# Altium project FMC_ADC_100M_10B_16CHA_TDC.PrjPCB (part 2 of 4)

## Sheet Clock_circuit.SchDoc: FMC_ADC
size 420 x 297 mm; Author: G.Kasprowicz; CompanyName: WUT ISE; DrawnBy: G.Kasprowicz; Organization: WUT ISE; Address1: PW ISE; Address2: Nowowiejska 15/19 00-665 Warsaw; Address3: gkasprow@gmail.com; DocumentNumber: 6; Revision: 2; SheetNumber: 6; SheetTotal: 12; ModifiedBy: -; CheckedDate: -; Title2: Clock distribution; DivGrp: WUT ISE; Designer: G.Kasprowicz; ModifiedDate: -; ProjectName: Sensor Box
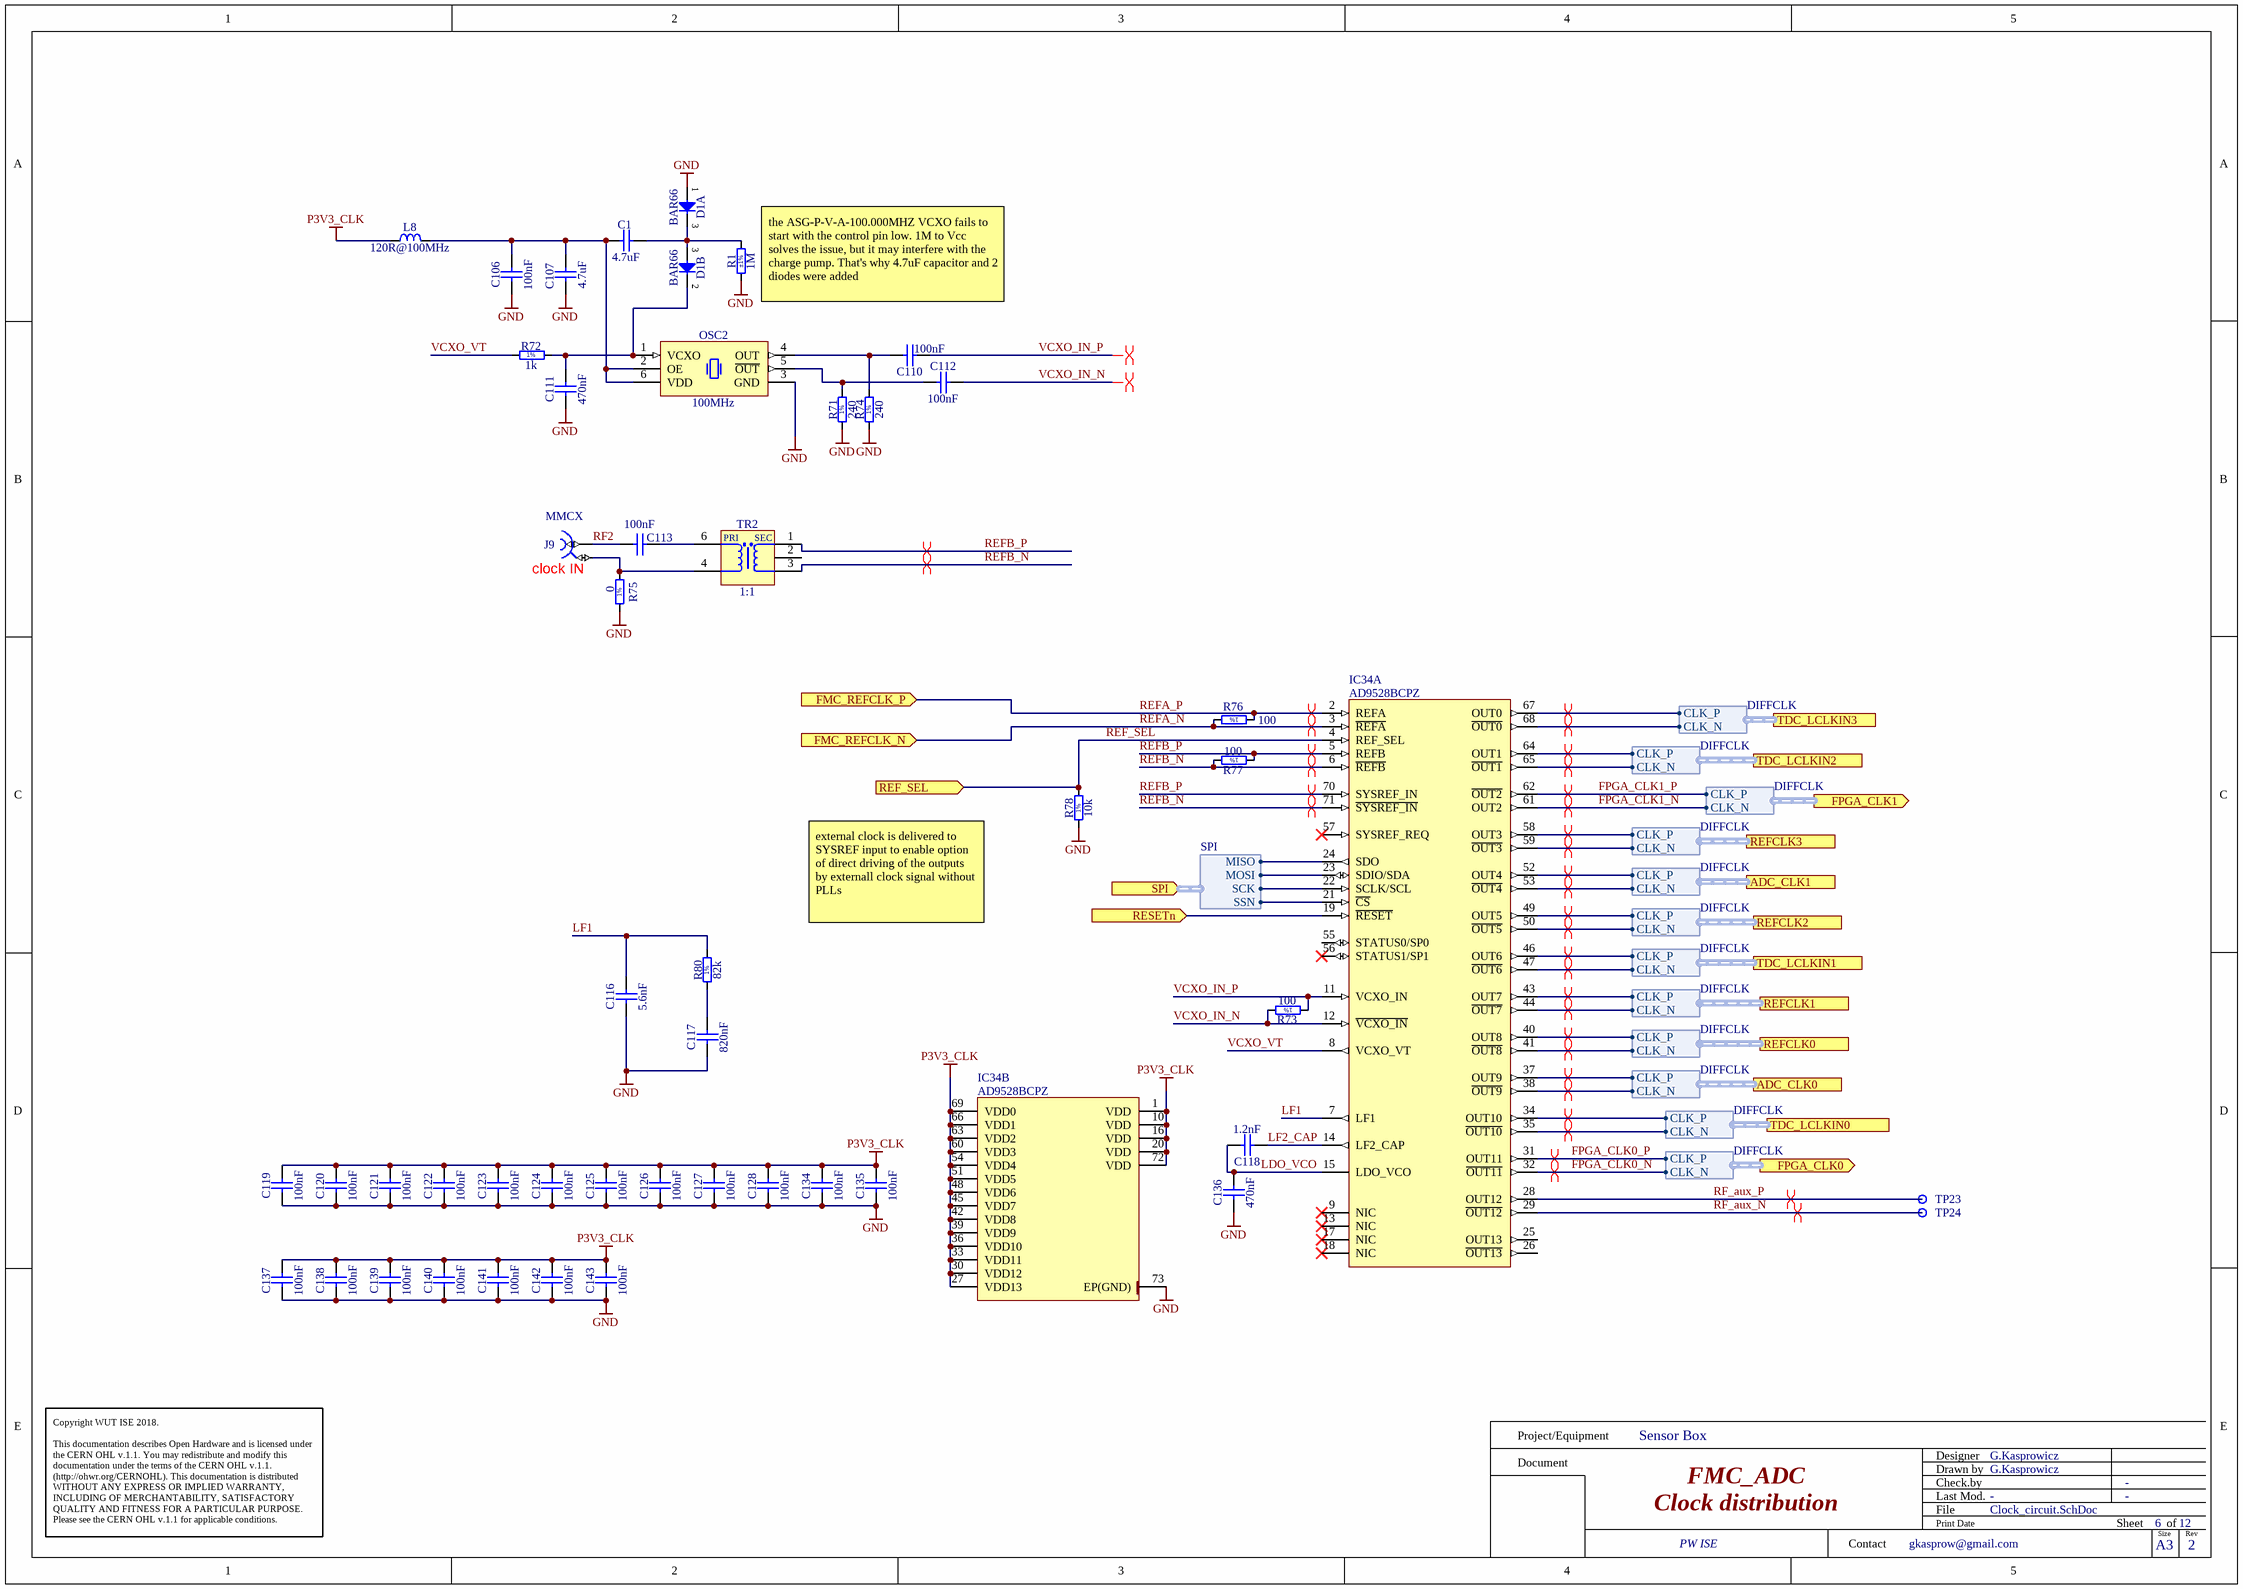
[diagram p3: Clock_circuit.SchDoc]

### Parts
C1  4.7uF  [CAPC1608X87N]
C106  100nF  [CAPC0603X33N]
C107  4.7uF  [CAPC1608X87N]
C110  100nF  [CAPC0603X33N]
C111  470nF  [CAPC1005X55N]
C112  100nF  [CAPC0603X33N]
C113  100nF  [CAPC0603X33N]
C116  5.6nF  [CAPC2012X88N]
C117  820nF  [CAPC3216X130N]
C118  1.2nF  [CAPC1608X80N]
C119  100nF  [CAPC0603X33N]
C120  100nF  [CAPC0603X33N]
C121  100nF  [CAPC0603X33N]
C122  100nF  [CAPC0603X33N]
C123  100nF  [CAPC0603X33N]
C124  100nF  [CAPC0603X33N]
C125  100nF  [CAPC0603X33N]
C126  100nF  [CAPC0603X33N]
C127  100nF  [CAPC0603X33N]
C128  100nF  [CAPC0603X33N]
C134  100nF  [CAPC0603X33N]
C135  100nF  [CAPC0603X33N]
C136  470nF  [CAPC1005X55N]
C137  100nF  [CAPC0603X33N]
C138  100nF  [CAPC0603X33N]
C139  100nF  [CAPC0603X33N]
C140  100nF  [CAPC0603X33N]
C141  100nF  [CAPC0603X33N]
C142  100nF  [CAPC0603X33N]
C143  100nF  [CAPC0603X33N]
D1  BAR66  [SOT95P240X110-3N]  (parts A,B of 2)
IC34  AD9528BCPZ  [QFN50P1000X1000X100-73N-S545]  (parts A,B of 2)
J9  Family: MMCX  [HUBER-SUHNER_85_MMCX-50-0-1/111 OH]  (hidden comment: Coax_1Female_1Shield)
L8  120R@100MHz  [INDC1608X65N]
OSC2  100MHz  [OSCSC254P500X700X190-6N]
R1  1M  Tolerance: ±1%  [RESC1005X40N]
R71  240  [RESC1005X40N]
R72  1k  [RESC1005X40N]
R73  100  [RESC0603X28N]
R74  240  [RESC1005X40N]
R75  0  [RESC1005X40N]
R76  100  [RESC0603X28N]
R77  100  [RESC0603X28N]
R78  10k  [RESC1005X40N]
R80  82k  [RESC1005X40N]
TP23  Test Point  [TPS127]  (value not drawn)
TP24  Test Point  [TPS127]  (value not drawn)
TR2  1:1  [XFMR_MINI-CIRCUITS_AT224-1]

### Ports
ADC_CLK0 (harness DIFFCLK), ADC_CLK1 (harness DIFFCLK), FMC_REFCLK_N (in), FMC_REFCLK_P (in), FPGA_CLK0 (out, harness DIFFCLK), FPGA_CLK1 (out, harness DIFFCLK), REF_SEL (in), REFCLK0 (harness DIFFCLK), REFCLK1 (harness DIFFCLK), REFCLK2 (harness DIFFCLK), REFCLK3 (harness DIFFCLK), RESETn (in), SPI (in, harness SPI), TDC_LCLKIN0 (harness DIFFCLK), TDC_LCLKIN1 (harness DIFFCLK), TDC_LCLKIN2 (harness DIFFCLK), TDC_LCLKIN3 (harness DIFFCLK)

### Harnesses
DIFFCLK: CLK_P, CLK_N
SPI: MISO, MOSI, SCK, SSN

### Nets
GND: C106.1 C107.1 C111.1 C116.1 C117.1 C119.1 C120.1 C121.1 C122.1 C123.1 C124.1 C125.1 C126.1 C127.1 C128.1 C134.1 C135.1 C136.1 C137.1 C138.1 C139.1 C140.1 C141.1 C142.1 C143.1 D1.1(A) IC34.73(EP(GND)) OSC2.3(GND) R1.1 R71.1 R74.1 R75.1 R78.1
P3V3_CLK: C119.2 C120.2 C121.2 C122.2 C123.2 C124.2 C125.2 C126.2 C127.2 C128.2 C134.2 C135.2 C137.2 C138.2 C139.2 C140.2 C141.2 C142.2 C143.2 IC34.1(VDD) IC34.10(VDD) IC34.16(VDD) IC34.20(VDD) IC34.27(VDD13) IC34.30(VDD12) IC34.33(VDD11) IC34.36(VDD10) IC34.39(VDD9) IC34.42(VDD8) IC34.45(VDD7) IC34.48(VDD6) IC34.51(VDD5) IC34.54(VDD4) IC34.60(VDD3) IC34.63(VDD2) IC34.66(VDD1) IC34.69(VDD0) IC34.72(VDD) L8.1
ADC_CLK_N: IC34.38(~{OUT9}) ; port ADC_CLK0.CLK_N
ADC_CLK_N: IC34.53(~{OUT4}) ; port ADC_CLK1.CLK_N  [a separate net that carries the same name]
ADC_CLK_P: IC34.37(OUT9) ; port ADC_CLK0.CLK_P
ADC_CLK_P: IC34.52(OUT4) ; port ADC_CLK1.CLK_P  [a separate net that carries the same name]
CLK_SSN: IC34.21(~{CS}) ; port SPI.SSN
FPGA_CLK0_N: IC34.32(~{OUT11}) ; port FPGA_CLK0.CLK_N  [project net CLK0_M2C_N]
FPGA_CLK0_P: IC34.31(OUT11) ; port FPGA_CLK0.CLK_P  [project net CLK0_M2C_P]
FPGA_CLK1_N: IC34.61(OUT2) ; port FPGA_CLK1.CLK_N  [project net CLK1_M2C_N]
FPGA_CLK1_P: IC34.62(~{OUT2}) ; port FPGA_CLK1.CLK_P  [project net CLK1_M2C_P]
LCLKIN_N: IC34.35(~{OUT10}) ; port TDC_LCLKIN0.CLK_N
LCLKIN_N: IC34.47(~{OUT6}) ; port TDC_LCLKIN1.CLK_N  [a separate net that carries the same name]
LCLKIN_N: IC34.65(~{OUT1}) ; port TDC_LCLKIN2.CLK_N  [a separate net that carries the same name]
LCLKIN_N: IC34.68(~{OUT0}) ; port TDC_LCLKIN3.CLK_N  [a separate net that carries the same name]
LCLKIN_P: IC34.34(OUT10) ; port TDC_LCLKIN0.CLK_P
LCLKIN_P: IC34.46(OUT6) ; port TDC_LCLKIN1.CLK_P  [a separate net that carries the same name]
LCLKIN_P: IC34.64(OUT1) ; port TDC_LCLKIN2.CLK_P  [a separate net that carries the same name]
LCLKIN_P: IC34.67(OUT0) ; port TDC_LCLKIN3.CLK_P  [a separate net that carries the same name]
LDO_VCO: C118.2 C136.2 IC34.15(LDO_VCO)
LF1: C116.2 IC34.7(LF1) R80.2
LF2_CAP: C118.1 IC34.14(LF2_CAP)
REF_SEL: IC34.4(REF_SEL) R78.2 ; port REF_SEL
REFA_N: IC34.3(~{REFA}) R76.2 ; port FMC_REFCLK_N
REFA_P: IC34.2(REFA) R76.1 ; port FMC_REFCLK_P
REFB_N: IC34.6(~{REFB}) IC34.71(~{SYSREF_IN}) R77.2 TR2.3(S)
REFB_P: IC34.5(REFB) IC34.70(SYSREF_IN) R77.1 TR2.1(SDOT)
REFCLK_N: IC34.41(~{OUT8}) ; port REFCLK0.CLK_N
REFCLK_N: IC34.44(~{OUT7}) ; port REFCLK1.CLK_N  [a separate net that carries the same name]
REFCLK_N: IC34.50(~{OUT5}) ; port REFCLK2.CLK_N  [a separate net that carries the same name]
REFCLK_N: IC34.59(~{OUT3}) ; port REFCLK3.CLK_N  [a separate net that carries the same name]
REFCLK_P: IC34.40(OUT8) ; port REFCLK0.CLK_P
REFCLK_P: IC34.43(OUT7) ; port REFCLK1.CLK_P  [a separate net that carries the same name]
REFCLK_P: IC34.49(OUT5) ; port REFCLK2.CLK_P  [a separate net that carries the same name]
REFCLK_P: IC34.58(OUT3) ; port REFCLK3.CLK_P  [a separate net that carries the same name]
RF2: C113.2 J9.1
RF_aux_N: IC34.29(~{OUT12}) TP24.1
RF_aux_P: IC34.28(OUT12) TP23.1
TDC_MISO: IC34.24(SDO) ; port SPI.MISO
TDC_MOSI: IC34.23(SDIO/SDA) ; port SPI.MOSI
TDC_SCK: IC34.22(SCLK/SCL) ; port SPI.SCK
VCXO_IN_N: C112.2 IC34.12(~{VCXO_IN}) R73.2
VCXO_IN_P: C110.1 IC34.11(VCXO_IN) R73.1
VCXO_VT: IC34.8(VCXO_VT) R72.1
NetC1_1: C1.1 C106.2 C107.2 L8.2 OSC2.2(OE) OSC2.6(VDD)
NetC1_2: C1.2 D1.3(COMAC) R1.2
NetC110_2: C110.2 OSC2.4(OUT) R74.2
NetC111_2: C111.2 D1.2(C) OSC2.1(VCXO) R72.2
NetC112_1: C112.1 OSC2.5(~{OUT}) R71.2
NetC113_1: C113.1 TR2.6(PDOT)
NetC117_2: C117.2 R80.1
NetIC5_13: IC34.19(~{RESET}) ; port RESETn
NetJ9_2: J9.2 R75.2 TR2.4(P)

Not connected (* = marked no-connect by the designer): IC34 9(NIC)* 13(NIC)* 17(NIC)* 18(NIC)* 25(OUT13) 26(~{OUT13}) 55(STATUS0/SP0) 56(STATUS1/SP1)* 57(SYSREF_REQ)*; TR2 2(NU)

### Layout directives
differential pair: ADC_CLK_N, ADC_CLK_P, CLK0_M2C_N, CLK0_M2C_P, CLK1_M2C_N, CLK1_M2C_P, LCLKIN_N, LCLKIN_P, REFA_N, REFA_P, REFB_N, REFB_P, REFCLK_N, REFCLK_P, RF_aux_N, RF_aux_P, VCXO_IN_N, VCXO_IN_P

### Notes on the sheet
- (near R1) the ASG-P-V-A-100.000MHZ VCXO fails to start with the control pin low. 1M to Vcc solves the issue, but it may interfere with the charge pump. That's why 4.7uF capacitor and 2 diodes were added
- (near J9) clock IN
- external clock is delivered to SYSREF input to enable option of direct driving of the outputs by externall clock signal without PLLs
- Project/Equipment
- Document
- Designer
- Drawn by
- Check.by
- Copyright WUT ISE 2018.
  This documentation describes Open Hardware and is licensed under the CERN OHL v.1.1. You may redistribute and modify this documentation under the terms of the CERN OHL v.1.1. (http://ohwr.org/CERNOHL). This documentation is distributed WITHOUT ANY EXPRESS OR IMPLIED WARRANTY, INCLUDING OF MERCHANTABILITY, SATISFACTORY QUALITY AND FITNESS FOR A PARTICULAR PURPOSE. Please see the CERN OHL v.1.1 for applicable conditions.
- Contact
- File
- Last Mod.
- Print Date
- Sheet
- Size
- A3
- of
- Rev
- (in symbol R0201_100R_1%_0.05W_200PPM) 1%
- (in symbol R0402_0R_JUMPER) 1%
- (in symbol R0402_1K_1%_0.0625W_100PPM) 1%
- (in symbol R0402_10K_1%_0.0625W_100PPM) 1%
- (in symbol R0402_82K_1%_0.0625W_100PPM) 1%
- (in symbol R0402_240R_1%_0.0625W_100PPM) 1%
- (in symbol XFMR_MINI-CIRCUITS_TC1-1+) PRI; SEC

### Library data of the parts
C1 C107 = CC0603_4.7UF_6.3V_10%_X5R: Non-polarised capacitor; Part Description: SMD Multilayer Chip Ceramic Capacitor; Manufacturer: GENERIC; Manufacturer1 Part Number: 225520613672; Voltage: 6.3V; TC: X5R; Tolerance: ±10%; Part Number: CC0603_4.7UF_6.3V_10%_X5R; Component Kind: Standard; Component Type: Standard; Pin Count: 2; Value: 4.7uF; Status: Preferred; Manufacturer Part Number: CC0603_4.7uF_6.3V_10%_X5R; Case: 0603; Mounted: Yes; Socket: No; SMD: Yes; Manufacturer1 Example: PHYCOMP; Manufacturer1 ComponentHeight: 0.87mm; HelpURL: \\cern.ch\dfs\Applications\Altium\Datasheets\CC0805_X5R_PHYCOMP_HC.pdf; Author: CERN DEM JLC; CreateDate: 03.12.2007; LatestRevisionDate: 03.12.2007; Sense: No
C106 C110 C112 C119-C128 C134 C135 C137-C143 = CC0201_100NF_6.3V_10%_X5R: Non-polarised capacitor; Part Description: SMD Multilayer Chip Ceramic Capacitor; Manufacturer: GENERIC; Manufacturer1 Part Number: 02016D104KAT2A; Tolerance: ±10%; Voltage: 6.3V; TC: X5R; Value: 100nF; Part Number: CC0201_100NF_6.3V_10%_X5R; Component Kind: Standard; Component Type: Standard; Pin Count: 2; Status: Not Recommended; Manufacturer Part Number: CC0201_100NF_6.3V_10%_X5R; Case: 0201; Mounted: Yes; Socket: No; SMD: Yes; Sense: No; Manufacturer1 Example: AVX; Manufacturer1 ComponentHeight: 0.33mm; HelpURL: \\cern.ch\dfs\Applications\Altium\Datasheets\CC0201_X5R_AVX.pdf; Author: CERN DEM JLC; CreateDate: 03.12.2007; LatestRevisionDate: 03.12.2007
C111 C136 = CC0402_470NF_6.3V_10%_X5R: Non-polarised capacitor; Part Description: SMD Multilayer Chip Ceramic Capacitor; Manufacturer: GENERIC; Manufacturer1 Part Number: GRM155R60J474KE19D; Tolerance: ±10%; Voltage: 6.3V; TC: X5R; Value: 470nF; Part Number: CC0402_470NF_6.3V_10%_X5R; Component Kind: Standard; Component Type: Standard; Pin Count: 2; Status: Preferred; Manufacturer Part Number: CC0402_470NF_6.3V_10%_X5R; Case: 0402; Mounted: Yes; Socket: No; SMD: Yes; Sense: No; Manufacturer1 Example: MURATA; Manufacturer1 ComponentHeight: 0.55mm; HelpURL: \\cern.ch\dfs\Applications\Altium\Datasheets\CC0402_X5R_MURATA_GRM.pdf; Author: CERN DEM JLC; CreateDate: 22.04.2010; LatestRevisionDate: 22.04.2010
C113 = CC0201_100NF_6.3V_10%_X5R: Non-polarised capacitor; Part Description: SMD Multilayer Chip Ceramic Capacitor; Manufacturer: GENERIC; Manufacturer1 Part Number: 02016D104KAT2A; Voltage: 6.3V; TC: X5R; Tolerance: ±10%; Table: Capacitors SMD; Part Number: CC0201_100NF_6.3V_10%_X5R; Component Kind: Standard; Component Type: Standard; Pin Count: 2; Value: 100nF; Status: Not Recommended; Manufacturer Part Number: CC0201_100NF_6.3V_10%_X5R; Case: 0201; Mounted: Yes; Socket: No; SMD: Yes; Manufacturer1 Example: AVX; Manufacturer1 ComponentHeight: 0.33mm; HelpURL: \\cern.ch\dfs\Applications\Altium\Datasheets\CC0201_X5R_AVX.pdf; Author: CERN DEM JLC; CreateDate: 2007-12-03; LatestRevisionDate: 2007-12-03
C116 = CC0805_5.6NF_50V_5%_C0G: Non-polarised capacitor; Part Description: SMD Multilayer Chip Ceramic Capacitor; Manufacturer: GENERIC; Manufacturer1 Part Number: GRM2195C1H562JA01D; Voltage: 50V; TC: C0G/NP0; Tolerance: ±5%; Part Number: CC0805_5.6NF_50V_5%_C0G; Component Kind: Standard; Component Type: Standard; Pin Count: 2; Value: 5.6nF; Status: Preferred; Manufacturer Part Number: CC0805_5.6NF_50V_5%_C0G; Case: 0805; Mounted: Yes; Socket: No; SMD: Yes; Sense: No; Manufacturer1 Example: Murata; Manufacturer1 ComponentHeight: 0.85mm; Author: *
C117 = CC1206_820NF_25V_10%_X7R: Non-polarised capacitor; Part Description: SMD Multilayer Chip Ceramic Capacitor; Manufacturer: GENERIC; Manufacturer1 Part Number: 12063C824KAT2A; Voltage: 25V; TC: X7R; Tolerance: ±10%; Part Number: CC1206_820NF_25V_10%_X7R; Component Kind: Standard; Component Type: Standard; Pin Count: 2; Value: 820nF; Manufacturer Part Number: CC1206_820NF_25V_10%_X7R; Case: 1206; Mounted: Yes; Socket: No; SMD: Yes; Sense: No; Manufacturer1 ComponentHeight: 1.25mm; Manufacturer1 Example: AVX
C118 = CC0603_1.2NF_50V_5%_C0G: Non-polarised capacitor; Part Description: SMD Multilayer Chip Ceramic Capacitor; Manufacturer: GENERIC; Manufacturer1 Part Number: C0603C122J5GACTU; Tolerance: ±5%; Voltage: 50V; TC: C0G/NP0; Value: 1.2nF; Part Number: CC0603_1.2NF_50V_5%_C0G; Component Kind: Standard; Component Type: Standard; Pin Count: 2; Status: Preferred; Manufacturer Part Number: CC0603_1.2NF_50V_5%_C0G; Case: 0603; Mounted: Yes; Socket: No; SMD: Yes; Sense: No; Manufacturer1 Example: KEMET; Manufacturer1 ComponentHeight: 0.8mm; Author: *
D1 = BAR66: Serial Diode; Part Description: Silicon PIN Diode Array (Series Connected); Manufacturer: INFINEON; Voltage: 150V; Power: 250mA; Table: Diodes; Part Number: BAR66; Component Kind: Standard; Component Type: Standard; Device: BAR66; PackageDescription: SOT23 3-Leads, Pitch 0.95mm - Body 1.3x2.9mm, IPC Medium Density; Manufacturer Part Number: BAR66; Pin Count: 3; Case: SOT23; Mounted: Yes; Socket: No; SMD: Yes; ComponentHeight: 1.1mm; HelpURL: \\cern.ch\dfs\Applications\Altium\Datasheets\BAR66.pdf; Author: CERN DEM JLC; CreateDate: 18/1/2010; LatestRevisionDate: 5/10/2010
IC34 = AD9528BCPZ: Clock Generator with 14 LVDS/HSTL Outputs; Manufacturer: ANALOG DEVICES; PressFit: No; Bonding: No; Part Number: AD9528BCPZ; Component Kind: Standard; Component Type: Standard; Device: AD9528BCPZ; PackageDescription: QFN,0.50mm Pitch, Square;72 Pin,10.00mm L X 10.00mm W X 1.00mm H Body (W/Thermal Tab 5.45mm X 5.45mm), IPC Medium Density; Part Description: Clock Generator with 14 LVDS/HSTL Outputs; Manufacturer Part Number: AD9528BCPZ; Pin Count: 73; Case: QFN72; Mounted: Yes; Socket: No; SMD: Yes; Sense: No; ComponentHeight: 1mm; HelpURL: \\cern.ch\dfs\Applications\Altium\Datasheets\AD9528BCPZ.pdf; Author: CERN DEM JLC; CreateDate: 11.10.2016; LatestRevisionDate: 11.10.2016
J9 = HUBER-SUHNER_85_MMCX-50-0-1/111 OH: Part Description: MMCX 50 Ohms Right Angle PCB Jack; Manufacturer: HUBER+SUHNER; Table: Miscellaneous; Part Number: HUBER-SUHNER_85_MMCX-50-0-1/111 OH; Component Kind: Standard; Component Type: Standard; Pin Count: 2; Mounted: Yes; Socket: No; SMD: No; Status: None; Manufacturer Part Number: 85_MMCX-50-0-1/111 OH; ComponentHeight: 9.6mm; HelpURL: \\cern.ch\dfs\Applications\Altium\Datasheets\HUBER-SUHNER_85_MMCX-50-0-1-111 OH.pdf; Author: CERN DEM JLC; CreateDate: 2011-10-04; LatestRevisionDate: 2011-10-04
L8 = IND0603_MURATA_BLM18SG121TN1D: Inductor; Part Description: SMD EMIFIL Suppression Chip Ferrite Bead; Manufacturer: MURATA; Power: 3A; Resistance: 0.025R; Tolerance: ±25%; Part Number: IND0603_MURATA_BLM18SG121TN1D; Component Kind: Standard; Component Type: Standard; Pin Count: 2; Value: 120R@100MHz; Status: None; Manufacturer Part Number: BLM18SG121TN1D; Case: 0603; Mounted: Yes; Socket: No; SMD: Yes; Sense: No; ComponentHeight: 0.65mm; HelpURL: \\cern.ch\dfs\Applications\Altium\Datasheets\IND0603_MURATA_BLM18S.pdf; Author: CERN DEM JLC; CreateDate: 23.07.2014; LatestRevisionDate: 23.07.2014
OSC2 = OSC_100MHz_LVPECL: VCXO 100MHz Oscillator; Part Number: OSC_100MHZ_ABRACON_ASG-P-V-A-100.000MHZ; Part Description: Stability: ± 50ppm, -40°C to +85°C, Programmable - High Performance SMD XO, LVPECL Output, ASG-P Series; Manufacturer: ABRACON; Manufacturer Part Number: ASG-P-V-A-100.000MHZ; PressFit: No; Bonding: No; Component Kind: Standard; Component Type: Standard; PackageDescription: Oscillator, side concave; 2.54mm pitch; 6 pin, 5.00mm L X 7.00mm W X 1.90mm H, IPC Medium Density; Value: 100MHz; Pin Count: 6; Mounted: Yes; Socket: No; SMD: Yes; Sense: No; ComponentHeight: 1.9mm; HelpURL: \\cern.ch\dfs\Applications\Altium\Datasheets\OSC_ABRACON_ASG-D.pdf; Author: GK; CreateDate: 20.04.2016; LatestRevisionDate: 20.04.2016
R1 = R0402_1M_1%_0.0625W_100PPM: Resistor - 1%; Part Description: General Purpose Thick Film Chip Resistor; Manufacturer: GENERIC; Manufacturer1 Part Number: 232270671005L; TC: ±100ppm/°C; PressFit: No; Part Number: R0402_1M_1%_0.0625W_100PPM; Component Kind: Standard; Component Type: Standard; Pin Count: 2; Value: 1M; Status: Not Recommended; Power: 0.0625W; Manufacturer Part Number: R0402_1M_1%_0.0625W_100PPM; Case: 0402; Mounted: Yes; Sense: No; Socket: No; SMD: Yes; Manufacturer1 Example: YAGEO PHYCOMP; Manufacturer1 ComponentHeight: 0.4mm; HelpURL: \\cern.ch\dfs\Applications\Altium\Datasheets\R0402_Phycomp_RC0402.pdf; Author: CERN DEM JLC; CreateDate: 03.12.2007; LatestRevisionDate: 17.10.2012
R71 R74 = R0402_240R_1%_0.0625W_100PPM: Resistor - 1%; Part Description: General Purpose Thick Film Chip Resistor; Manufacturer: GENERIC; Manufacturer1 Part Number: 232270672401L; TC: ±100ppm/°C; PressFit: No; Part Number: R0402_240R_1%_0.0625W_100PPM; Component Kind: Standard; Component Type: Standard; Pin Count: 2; Value: 240; Status: Not Recommended; Power: 0.0625W; Tolerance: ±1%; Manufacturer Part Number: R0402_240R_1%_0.0625W_100PPM; Case: 0402; Mounted: Yes; Sense: No; Socket: No; SMD: Yes; Manufacturer1 Example: YAGEO PHYCOMP; Manufacturer1 ComponentHeight: 0.4mm; HelpURL: \\cern.ch\dfs\Applications\Altium\Datasheets\R0402_Phycomp_RC0402.pdf; Author: CERN DEM JLC; CreateDate: 03.12.2007; LatestRevisionDate: 17.10.2012
R72 = R0402_1K_1%_0.0625W_100PPM: Resistor - 1%; Part Description: General Purpose Thick Film Chip Resistor; Manufacturer: GENERIC; Manufacturer1 Part Number: 232270671002L; TC: ±100ppm/°C; Tolerance: ±1%; Value: 1k; Power: 0.0625W; Part Number: R0402_1K_1%_0.0625W_100PPM; Component Kind: Standard; Component Type: Standard; Pin Count: 2; Status: Not recommended; Manufacturer Part Number: R0402_1K_1%_0.0625W_100PPM; Case: 0402; Mounted: Yes; Sense: No; Socket: No; SMD: Yes; Manufacturer1 Example: YAGEO PHYCOMP; Manufacturer1 ComponentHeight: 0.4mm; HelpURL: \\cern.ch\dfs\Applications\Altium\Datasheets\R0402_Phycomp_RC0402.pdf; Author: CERN DEM JLC; CreateDate: 03.12.2007; LatestRevisionDate: 17.10.2012
R73 R76 R77 = R0201_100R_1%_0.05W_200PPM: Resistor - 1%; Part Description: Thick Film Chip Resistor; Manufacturer: GENERIC; Manufacturer1 Part Number: CRCW0201100RFNED; Power: 0.05W; TC: ±200ppm/°C; PressFit: No; Part Number: R0201_100R_1%_0.05W_200PPM; Component Kind: Standard; Component Type: Standard; Pin Count: 2; Value: 100; Status: Not Recommended; Tolerance: ±1%; Manufacturer Part Number: R0201_100R_1%_0.05W_200PPM; Case: 0201; Mounted: Yes; Socket: No; SMD: Yes; Manufacturer1 Example: VISHAY; Manufacturer1 ComponentHeight: 0.27mm; HelpURL: \\cern.ch\dfs\Applications\Altium\Datasheets\R0201_VISHAY_CRCW0201 e3.pdf; Author: CERN DEM JLC; CreateDate: 13.11.2014; LatestRevisionDate: 13.11.2014; Sense: No
R75 = R0402_0R_JUMPER: Resistor - 1%; Part Description: 1A (0.05R Max DC Resistance) Zero Ohm Jumper; Manufacturer: GENERIC; Manufacturer1 Part Number: 232270591001L; Table: Resistors SMD; Part Number: R0402_0R_JUMPER; Component Kind: Standard; Component Type: Standard; Pin Count: 2; Value: 0; Status: Not recommended; Manufacturer Part Number: R0402_0R_JUMPER; Case: 0402; Mounted: Yes; Socket: No; SMD: Yes; Manufacturer1 Example: YAGEO PHYCOMP; Manufacturer1 ComponentHeight: 0.4mm; HelpURL: \\cern.ch\dfs\Applications\Altium\Datasheets\R0402_Phycomp_RC0402.pdf; Author: CERN DEM JLC; CreateDate: 3/12/2007; LatestRevisionDate: 17/10/2012
R78 = R0402_10K_1%_0.0625W_100PPM: Resistor - 1%; Part Description: General Purpose Thick Film Chip Resistor; Manufacturer: GENERIC; Manufacturer1 Part Number: 232270671003L; TC: ±100ppm/°C; Table: Resistors SMD; Part Number: R0402_10K_1%_0.0625W_100PPM; Component Kind: Standard; Component Type: Standard; Pin Count: 2; Value: 10k; Status: Not recommended; Power: 0.0625W; Tolerance: ±1%; Manufacturer Part Number: R0402_10K_1%_0.0625W_100PPM; Case: 0402; Mounted: Yes; Socket: No; SMD: Yes; Manufacturer1 Example: YAGEO PHYCOMP; Manufacturer1 ComponentHeight: 0.4mm; HelpURL: \\cern.ch\dfs\Applications\Altium\Datasheets\R0402_Phycomp_RC0402.pdf; Author: CERN DEM JLC; CreateDate: 3/12/2007; LatestRevisionDate: 17/10/2012
R80 = R0402_82K_1%_0.0625W_100PPM: Resistor - 1%; Part Description: General Purpose Thick Film Chip Resistor; Manufacturer: GENERIC; Manufacturer1 Part Number: 232270678203L; TC: ±100ppm/°C; Value: 82k; Tolerance: ±1%; Power: 0.0625W; Part Number: R0402_82K_1%_0.0625W_100PPM; Component Kind: Standard; Component Type: Standard; Pin Count: 2; Status: Not recommended; Manufacturer Part Number: R0402_82K_1%_0.0625W_100PPM; Case: 0402; Mounted: Yes; Sense: No; Socket: No; SMD: Yes; Manufacturer1 Example: YAGEO PHYCOMP; Manufacturer1 ComponentHeight: 0.4mm; HelpURL: \\cern.ch\dfs\Applications\Altium\Datasheets\R0402_Phycomp_RC0402.pdf; Author: CERN DEM JLC; CreateDate: 03.12.2007; LatestRevisionDate: 17.10.2012
TP23 TP24 = SMD_PAD_1.27X1.27MM: Part Description: 1.27mm x 1.27mm PCB Copper Area (SMD Test Point); Mounted: No; Part Number: SMD_PAD_1.27X1.27MM; Component Kind: Standard (No BOM); Component Type: Standard (No BOM); Pin Count: 1; Family: Test Point; Socket: No; SMD: Yes; Sense: No; Status: None; ComponentHeight: 0mm; HelpURL: Undefined; Author: CERN DEM JLC; CreateDate: 12.01.2008; LatestRevisionDate: 12.01.2008; PackageDescription: 1.27mm x 1.27mm PCB Copper Area (SMD Test Point)
TR2 = XFMR_MINI-CIRCUITS_TC1-1+: 50 Ohm  0.4 To 500MHz RF Transformers; Part Number: XFMR_MINI-CIRCUITS_TC1-1T+; Part Description: 50 Ohms 1.5 to 500 MHz RF Transformer; Manufacturer Part Number: TC1-1T+; Component Kind: Standard; Component Type: Standard; Pin Count: 5; Value: 1:1; Status: None; Manufacturer: MINI-CIRCUITS; Mounted: Yes; Socket: No; SMD: Yes; ComponentHeight: 4.06mm; HelpURL: \\cern.ch\dfs\Applications\Altium\Datasheets\XFMR_MINI-CIRCUITS_TC1-1+.pdf; Author: CERN DEM JLC; CreateDate: 2010-02-08; LatestRevisionDate: 2010-04-27; Table: Transformers

## Sheet EEPROM_Temp.SchDoc: FMC_ADC
size 420 x 297 mm; Author: G.Kasprowicz; CompanyName: WUT ISE; DrawnBy: G.Kasprowicz; Organization: WUT ISE; Address1: PW ISE; Address2: Nowowiejska 15/19 00-665 Warsaw; Address3: gkasprow@gmail.com; DocumentNumber: 9; Revision: 2; SheetNumber: 9; SheetTotal: 12; ModifiedBy: -; CheckedDate: -; Title2: EEPROM, temperature sensor; DivGrp: WUT ISE; Designer: G.Kasprowicz; ModifiedDate: -; ProjectName: Sensor Box
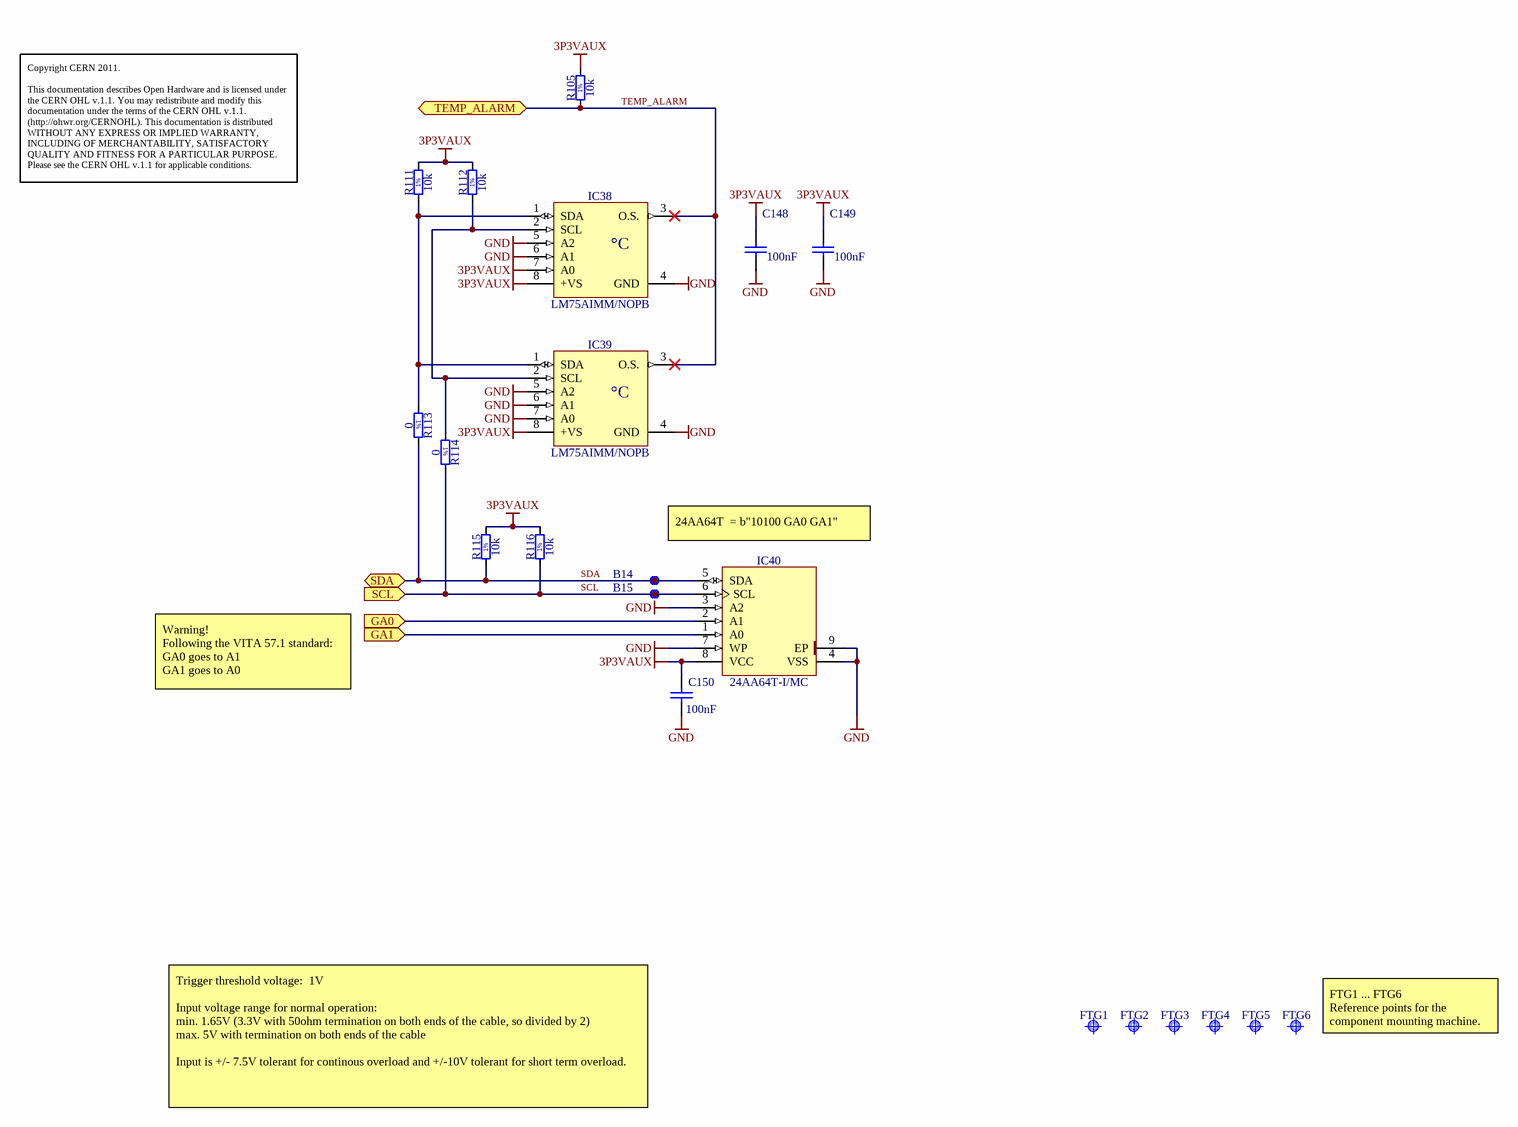
[diagram p4: EEPROM_Temp.SchDoc]

### Parts
B14  SMD Pad  [C100]  (value not drawn)
B15  SMD Pad  [C100]  (value not drawn)
C148  100nF  [CAPC0603X33N]
C149  100nF  [CAPC0603X33N]
C150  100nF  [CAPC0603X33N]
FTG1  Use only in PCB  [FIDUCIAL_TOP_S100-200]  (value not drawn)
FTG2  Use only in PCB  [FIDUCIAL_TOP_S100-200]  (value not drawn)
FTG3  Use only in PCB  [FIDUCIAL_TOP_S100-200]  (value not drawn)
FTG4  Use only in PCB  [FIDUCIAL_TOP_S100-200]  (value not drawn)
FTG5  Use only in PCB  [FIDUCIAL_TOP_S100-200]  (value not drawn)
FTG6  Use only in PCB  [FIDUCIAL_TOP_S100-200]  (value not drawn)
IC38  LM75AIMM/NOPB  [SOP65P490X109-8N]
IC39  LM75AIMM/NOPB  [SOP65P490X109-8N]
IC40  24AA64T-I/MC  [SON50P300X200X100-9N-S175X155]
R105  10k  [RESC1005X40N]
R111  10k  [RESC1005X40N]
R112  10k  [RESC1005X40N]
R113  0  [RESC1005X40N]
R114  0  [RESC1005X40N]
R115  10k  [RESC1005X40N]
R116  10k  [RESC1005X40N]

### Ports
GA0 (in), GA1 (in), SCL (in), SDA (bidir), TEMP_ALARM (bidir)

### Nets
3P3VAUX: C148.1 C149.1 C150.1 IC38.7(A0) IC38.8(+VS) IC39.8(+VS) IC40.8(VCC) R105.2 R111.2 R112.2 R115.2 R116.2
GND: C148.2 C149.2 C150.2 IC38.4(GND) IC38.5(A2) IC38.6(A1) IC39.4(GND) IC39.5(A2) IC39.6(A1) IC39.7(A0) IC40.3(A2) IC40.4(VSS) IC40.7(WP) IC40.9(EP)
GA0: IC40.2(A1) ; port GA0
GA1: IC40.1(A0) ; port GA1
SCL: B15.1 IC40.6(SCL) R114.2 R116.1 ; port SCL
SDA: B14.1 IC40.5(SDA) R113.2 R115.1 ; port SDA
TEMP_ALARM: IC38.3(O.S.) IC39.3(O.S.) R105.1 ; port TEMP_ALARM
NetIC38_1: IC38.1(SDA) IC39.1(SDA) R111.1 R113.1
NetIC38_2: IC38.2(SCL) IC39.2(SCL) R112.1 R114.1

### Notes on the sheet
- Copyright CERN 2011.
  This documentation describes Open Hardware and is licensed under the CERN OHL v.1.1. You may redistribute and modify this documentation under the terms of the CERN OHL v.1.1. (http://ohwr.org/CERNOHL). This documentation is distributed WITHOUT ANY EXPRESS OR IMPLIED WARRANTY, INCLUDING OF MERCHANTABILITY, SATISFACTORY QUALITY AND FITNESS FOR A PARTICULAR PURPOSE. Please see the CERN OHL v.1.1 for applicable conditions.
- 24AA64T  = b"10100 GA0 GA1"
- Warning!
  Following the VITA 57.1 standard:
  GA0 goes to A1
  GA1 goes to A0
- (near FTG6) FTG1 ... FTG6
  Reference points for the component mounting machine.
- Trigger threshold voltage:  1V
  Input voltage range for normal operation:
  min. 1.65V (3.3V with 50ohm termination on both ends of the cable, so divided by 2)
  max. 5V with termination on both ends of the cable
  Input is +/- 7.5V tolerant for continous overload and +/-10V tolerant for short term overload.
- Project/Equipment
- Document
- Designer
- Drawn by
- Check.by
- Copyright WUT ISE 2018.
  This documentation describes Open Hardware and is licensed under the CERN OHL v.1.1. You may redistribute and modify this documentation under the terms of the CERN OHL v.1.1. (http://ohwr.org/CERNOHL). This documentation is distributed WITHOUT ANY EXPRESS OR IMPLIED WARRANTY, INCLUDING OF MERCHANTABILITY, SATISFACTORY QUALITY AND FITNESS FOR A PARTICULAR PURPOSE. Please see the CERN OHL v.1.1 for applicable conditions.
- Contact
- File
- Last Mod.
- Print Date
- Sheet
- Size
- A3
- of
- Rev
- (in symbol LM75AIMM/NOPB) °C
- (in symbol R0402_0R_JUMPER) 1%
- (in symbol R0402_10K_1%_0.0625W_100PPM) 1%

### Library data of the parts
B14 B15 = SMD_PAD_D1MM: Through Hole Pad; Part Description: 1mm Diameter SMD Pad; Mounted: No; Part Number: SMD_PAD_D1MM; Component Kind: Standard (No BOM); Component Type: Standard (No BOM); Pin Count: 1; Family: SMD Pad; Socket: No; SMD: No; Sense: No; Status: None; ComponentHeight: 0mm; HelpURL: Undefined; Author: CERN DEM JLC; CreateDate: 10.10.2017; LatestRevisionDate: 10.10.2017; PackageDescription: 1mm Diameter SMD Pad
C148-C150 = CC0201_100NF_6.3V_10%_X5R: as C113 on sheet Clock_circuit; Part Number: CC0201_100NF_6.3V_10%_X5R; Component Kind: Standard; Component Type: Standard; Pin Count: 2; Value: 100nF; Status: Not Recommended; Manufacturer Part Number: CC0201_100NF_6.3V_10%_X5R; Case: 0201; Mounted: Yes; Socket: No; SMD: Yes; Manufacturer1 Example: AVX; Manufacturer1 ComponentHeight: 0.33mm; HelpURL: \\cern.ch\dfs\Applications\Altium\Datasheets\CC0201_X5R_AVX.pdf; Author: CERN DEM JLC; CreateDate: 2007-12-03; LatestRevisionDate: 2007-12-03
FTG1-FTG6 = FIDUCIAL_TARGET_S100-200: Fiducial Target; Part Description: Square Fiducial Target, Top Layer, 1.0mm, Top Solder 2.0mm, Keepout =2.0mm; Mounted: No; Table: Pads; Part Number: FIDUCIAL_TARGET_S100-200; Component Kind: Standard (No BOM); Component Type: Standard (No BOM); Pin Count: 1; Family: Fiducial; Socket: No; SMD: Yes; Status: None; ComponentHeight: 0mm; Author: CERN DEM JLC; CreateDate: 9/2/2010; LatestRevisionDate: 4/4/2012; PackageDescription: Square Fiducial Target, Top Layer, 1.0mm, Top Solder 2.0mm, Keepout =2.0mm
IC38 IC39 = LM75AIMM/NOPB: Digital Temperature Sensor and Thermal Watchdog with Two-Wire Interface; Part Description: -25° to +100°C ±2°C Digital Temperature Sensor and Thermal Watchdog with Two-Wire Interface; Manufacturer: TEXAS INSTRUMENTS; Table: Sensors; Part Number: LM75AIMM/NOPB; Component Kind: Standard; Component Type: Standard; Device: LM75AIMM/NOPB; PackageDescription: SOP, 0.65mm pitch; 8 pin,3.00mm W X 3.00mm L X 1.09mm H bodyI, PC Medium Density; Manufacturer Part Number: LM75AIMM/NOPB; Pin Count: 8; Case: SSOP8; Mounted: Yes; Socket: No; SMD: Yes; ComponentHeight: 1.09mm; HelpURL: \\cern.ch\dfs\Applications\Altium\Datasheets\LM75AIMM-NOPB.pdf; Author: CERN DEM JLC; CreateDate: 2012-10-15; LatestRevisionDate: 2012-10-15
IC40 = 24AA64T-I/MC: 1.7-5.5V 64K I2C Serial EEPROM; Part Description: 1.7V-5.5V, 64K  (8K x 8-bit) I2C Serial EEPROM; Manufacturer: MICROCHIP TECHNOLOGY; Table: Logic; Part Number: 24AA64T-I/MC; Component Kind: Standard; Component Type: Standard; Device: 24AA64T-I/MC; PackageDescription: SON (DFN), 0.50mm pitch, 8 pin, 2mm X 3mm X 1.00mm H body (w/thermal tab 1.75 X 1.55mm),  IPC Medium Density; Manufacturer Part Number: 24AA64T-I/MC; Pin Count: 9; Case: DFN8; Mounted: Yes; Socket: No; SMD: Yes; ComponentHeight: 1.0mm; HelpURL: \\cern.ch\dfs\Applications\Altium\Datasheets\24AA64T-I-MC.pdf; Author: CERN DEM JLC; CreateDate: 18/11/2009; LatestRevisionDate: 24/1/2011
R105 R111 R112 R115 R116 = R0402_10K_1%_0.0625W_100PPM: as R78 on sheet Clock_circuit; Part Number: R0402_10K_1%_0.0625W_100PPM; Component Kind: Standard; Component Type: Standard; Pin Count: 2; Value: 10k; Status: Not recommended; Power: 0.0625W; Tolerance: ±1%; Manufacturer Part Number: R0402_10K_1%_0.0625W_100PPM; Case: 0402; Mounted: Yes; Socket: No; SMD: Yes; Manufacturer1 Example: YAGEO PHYCOMP; Manufacturer1 ComponentHeight: 0.4mm; HelpURL: \\cern.ch\dfs\Applications\Altium\Datasheets\R0402_Phycomp_RC0402.pdf; Author: CERN DEM JLC; CreateDate: 3/12/2007; LatestRevisionDate: 17/10/2012
R113 R114 = R0402_0R_JUMPER: Resistor - 1%; Part Description: 1A (0.05R Max DC Resistance) Zero Ohm Jumper; Manufacturer: GENERIC; Manufacturer1 Part Number: 232270591001; Table: Resistors SMD; Part Number: R0402_0R_JUMPER; Component Kind: Standard; Component Type: Standard; Pin Count: 2; Value: 0; Status: Not recommended; Manufacturer Part Number: R0402_0R_JUMPER; Case: 0402; Mounted: Yes; Socket: No; SMD: Yes; Manufacturer1 Example: PHYCOMP; Manufacturer1 ComponentHeight: 0.4mm; HelpURL: \\cern.ch\dfs\Applications\Altium\Datasheets\R0402_Phycomp_RC0402.pdf; Author: CERN DEM JLC; CreateDate: 2007-12-03; LatestRevisionDate: 2008-03-13

## Sheet FMC connector.SchDoc: FMC_ADC
size 420 x 297 mm; Author: G.Kasprowicz; CompanyName: WUT ISE; DrawnBy: G.Kasprowicz; Organization: WUT ISE; Address1: PW ISE; Address2: Nowowiejska 15/19 00-665 Warsaw; Address3: gkasprow@gmail.com; DocumentNumber: 7; Revision: 2; SheetNumber: 7; SheetTotal: 12; ModifiedBy: -; CheckedDate: -; Title2: FMC HPC connector; DivGrp: WUT ISE; Designer: G.Kasprowicz; ModifiedDate: -; ProjectName: Sensor Box
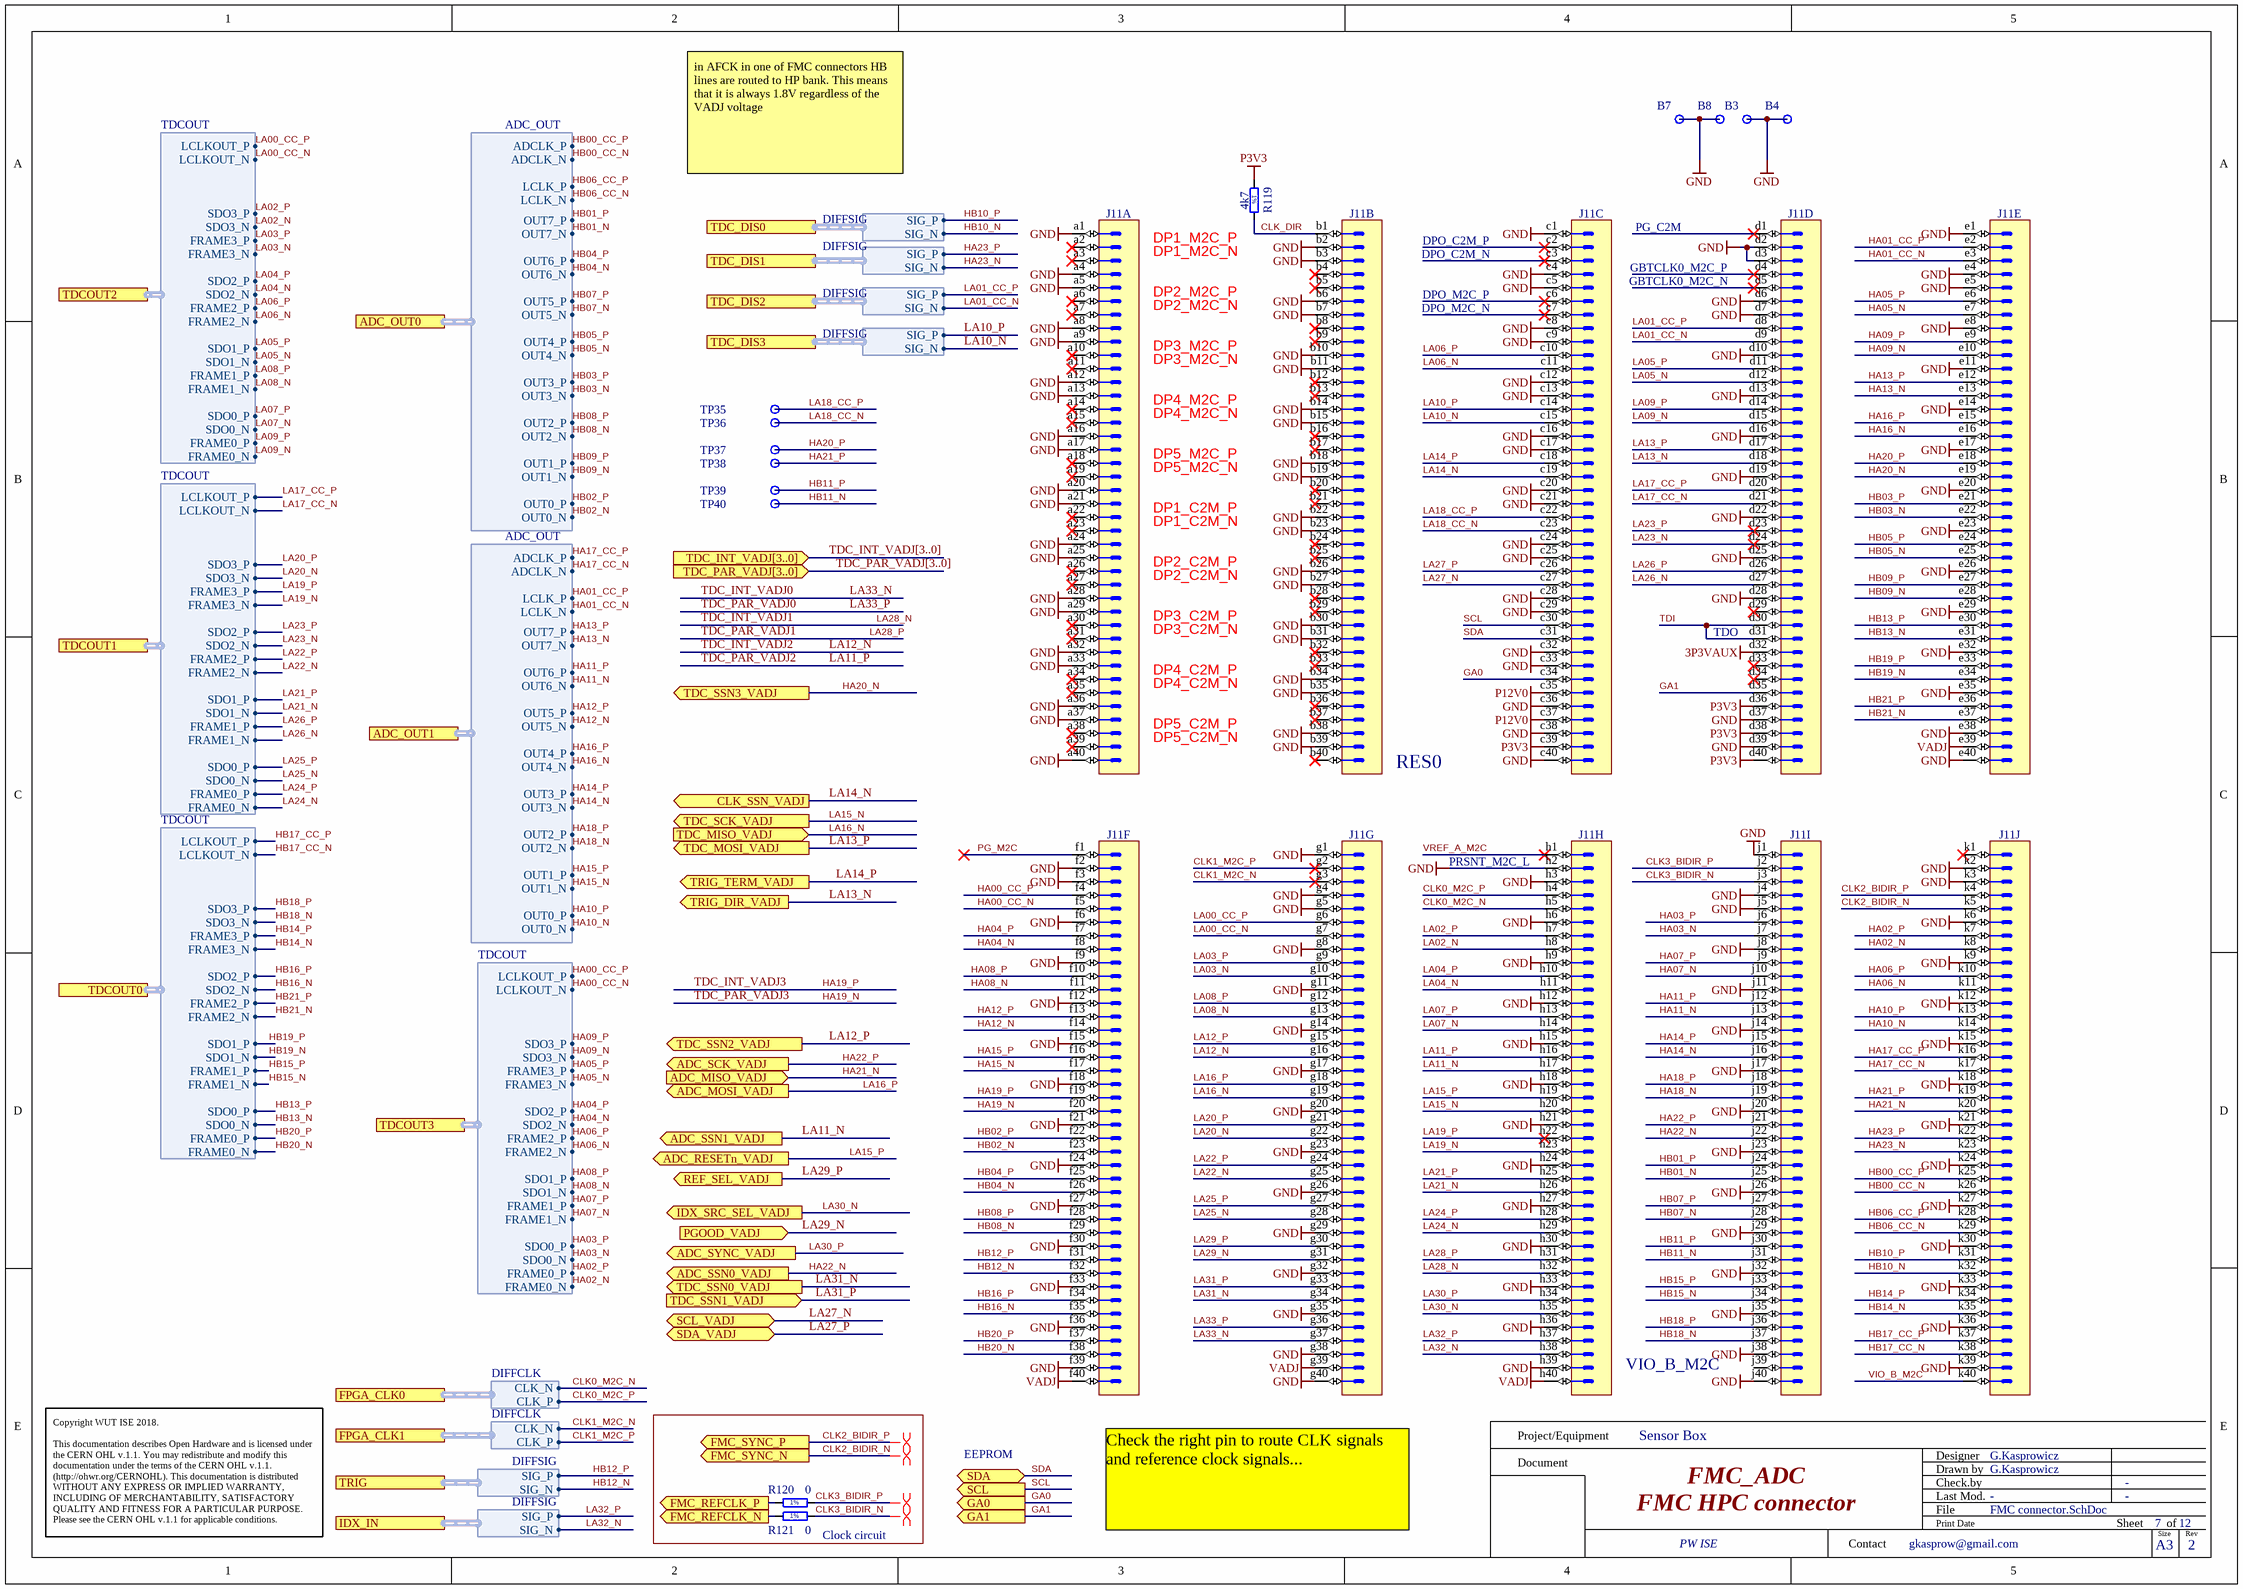
[diagram p5: FMC connector.SchDoc]

### Parts
B3  Plated Hole  [MTG300_600]  (value not drawn)
B4  Plated Hole  [MTG300_600]  (value not drawn)
B7  Plated Hole  [MTG300_600]  (value not drawn)
B8  Plated Hole  [MTG300_600]  (value not drawn)
J11  VITA 57  [SAMTEC_ASP-134488-01]  (value not drawn)  (parts A,B,C,D,E,F,G,H,I,J of 10)
R119  4k7  [RESC1608X55N]
R120  0  [RESC1005X40N]
R121  0  [RESC1005X40N]
TP35  Test Point  [TPS127]  (value not drawn)
TP36  Test Point  [TPS127]  (value not drawn)
TP37  Test Point  [TPS127]  (value not drawn)
TP38  Test Point  [TPS127]  (value not drawn)
TP39  Test Point  [TPS127]  (value not drawn)
TP40  Test Point  [TPS127]  (value not drawn)

### Blocks framed on the sheet
Clock circuit: R120 R121

### Ports
ADC_MISO_VADJ (in), ADC_MOSI_VADJ (out), ADC_OUT0 (harness ADC_OUT), ADC_OUT1 (harness ADC_OUT), ADC_RESETn_VADJ (out), ADC_SCK_VADJ (out), ADC_SSN0_VADJ (out), ADC_SSN1_VADJ (out), ADC_SYNC_VADJ (out), CLK_SSN_VADJ (out), FMC_REFCLK_N (out), FMC_REFCLK_P (out), FMC_SYNC_N (out), FMC_SYNC_P (out), FPGA_CLK0 (harness DIFFCLK), FPGA_CLK1 (harness DIFFCLK), GA0 (out), GA1 (out), IDX_IN (harness DIFFSIG), IDX_SRC_SEL_VADJ (out), PGOOD_VADJ (in), REF_SEL_VADJ (out), SCL (out), SCL_VADJ (bidir), SDA (bidir), SDA_VADJ (bidir), TDC_DIS0 (harness DIFFSIG), TDC_DIS1 (harness DIFFSIG), TDC_DIS2 (harness DIFFSIG), TDC_DIS3 (harness DIFFSIG), TDC_INT_VADJ[3..0] (in), TDC_MISO_VADJ (in), TDC_MOSI_VADJ (out), TDC_PAR_VADJ[3..0] (in), TDC_SCK_VADJ (out), TDC_SSN0_VADJ (out), TDC_SSN1_VADJ (in), TDC_SSN2_VADJ (out), TDC_SSN3_VADJ (out), TDCOUT0 (harness TDCOUT), TDCOUT1 (harness TDCOUT), TDCOUT2 (harness TDCOUT), TDCOUT3 (harness TDCOUT), TRIG (harness DIFFSIG), TRIG_DIR_VADJ (out), TRIG_TERM_VADJ (out)

### Harnesses
TDCOUT: FRAME0_N, FRAME0_P, SDO0_N, SDO0_P, FRAME1_N, FRAME1_P, SDO1_N, SDO1_P, FRAME2_N, FRAME2_P, SDO2_N, SDO2_P, FRAME3_N, FRAME3_P, SDO3_N, SDO3_P, LCLKOUT_N, LCLKOUT_P
ADC_OUT: LCLK_N, ADCLK_N, OUT7_N, OUT6_N, OUT5_N, OUT4_N, OUT3_N, OUT2_N, OUT1_N, OUT0_N, LCLK_P, ADCLK_P, OUT7_P, OUT6_P, OUT5_P, OUT4_P, OUT3_P, OUT2_P, OUT1_P, OUT0_P
DIFFCLK: CLK_P, CLK_N
DIFFSIG: SIG_N, SIG_P

### Nets
3P3VAUX: J11.d32
GND: B3.1 B4.1 B7.1 B8.1 J11.a1 J11.a4 J11.a5 J11.a8 J11.a9 J11.a12 J11.a13 J11.a16 J11.a17 J11.a20 J11.a21 J11.a24 J11.a25 J11.a28 J11.a29 J11.a32 J11.a33 J11.a36 J11.a37 J11.a40 J11.b2 J11.b3 J11.b6 J11.b7 J11.b10 J11.b11 J11.b14 J11.b15 J11.b18 J11.b19 J11.b22 J11.b23 J11.b26 J11.b27 J11.b30 J11.b31 J11.b34 J11.b35 J11.b38 J11.b39 J11.c1 J11.c4 J11.c5 J11.c8 J11.c9 J11.c12 J11.c13 J11.c16 J11.c17 J11.c20 J11.c21 J11.c24 J11.c25 J11.c28 J11.c29 J11.c32 J11.c33 J11.c36 J11.c38 J11.c40 J11.d2 J11.d3 J11.d6 J11.d7 J11.d10 J11.d13 J11.d16 J11.d19 J11.d22 J11.d25 J11.d28 J11.d37 J11.d39 J11.e1 J11.e4 J11.e5 J11.e8 J11.e11 J11.e14 J11.e17 J11.e20 J11.e23 J11.e26 J11.e29 J11.e32 J11.e35 J11.e38 J11.e40 J11.f2 J11.f3 J11.f6 J11.f9 J11.f12 J11.f15 J11.f18 J11.f21 J11.f24 J11.f27 J11.f30 J11.f33 J11.f36 J11.f39 J11.g1 J11.g4 J11.g5 J11.g8 J11.g11 J11.g14 J11.g17 J11.g20 J11.g23 J11.g26 J11.g29 J11.g32 J11.g35 J11.g38 J11.g40 J11.h2 J11.h3 J11.h6 J11.h9 J11.h12 J11.h15 J11.h18 J11.h21 J11.h24 J11.h27 J11.h30 J11.h33 J11.h36 J11.h39 J11.j1 J11.j4 J11.j5 J11.j8 J11.j11 J11.j14 J11.j17 J11.j20 J11.j23 J11.j26 J11.j29 J11.j32 J11.j35 J11.j38 J11.j40 J11.k2 J11.k3 J11.k6 J11.k9 J11.k12 J11.k15 J11.k18 J11.k21 J11.k24 J11.k27 J11.k30 J11.k33 J11.k36 J11.k39
P3V3: J11.c39 J11.d36 J11.d38 J11.d40 R119.1
P12V0: J11.c35 J11.c37
VADJ: J11.e39 J11.f40 J11.g39 J11.h40
CLK0_M2C_N: J11.h5 ; port FPGA_CLK0.CLK_N
CLK0_M2C_P: J11.h4 ; port FPGA_CLK0.CLK_P
CLK1_M2C_N: J11.g3 ; port FPGA_CLK1.CLK_N
CLK1_M2C_P: J11.g2 ; port FPGA_CLK1.CLK_P
CLK2_BIDIR_N: J11.k5 ; port FMC_SYNC_N
CLK2_BIDIR_P: J11.k4 ; port FMC_SYNC_P
CLK3_BIDIR_N: J11.j3 R121.2
CLK3_BIDIR_P: J11.j2 R120.2
CLK_DIR: J11.b1 R119.2
GA0: J11.c34 ; port GA0
GA1: J11.d35 ; port GA1
HA00_CC_N: J11.f5 ; port TDCOUT3.LCLKOUT_N
HA00_CC_P: J11.f4 ; port TDCOUT3.LCLKOUT_P
HA01_CC_N: J11.e3 ; port ADC_OUT1.LCLK_N
HA01_CC_P: J11.e2 ; port ADC_OUT1.LCLK_P
HA02_N: J11.k8 ; port TDCOUT3.FRAME0_N  [project net FRAME0_N]
HA02_P: J11.k7 ; port TDCOUT3.FRAME0_P  [project net FRAME0_P]
HA03_N: J11.j7 ; port TDCOUT3.SDO0_N
HA03_P: J11.j6 ; port TDCOUT3.SDO0_P
HA04_N: J11.f8 ; port TDCOUT3.SDO2_N
HA04_P: J11.f7 ; port TDCOUT3.SDO2_P
HA05_N: J11.e7 ; port TDCOUT3.FRAME3_N  [project net FRAME3_N]
HA05_P: J11.e6 ; port TDCOUT3.FRAME3_P  [project net FRAME3_P]
HA06_N: J11.k11 ; port TDCOUT3.FRAME2_N  [project net FRAME2_N]
HA06_P: J11.k10 ; port TDCOUT3.FRAME2_P  [project net FRAME2_P]
HA07_N: J11.j10 ; port TDCOUT3.FRAME1_N  [project net FRAME1_N]
HA07_P: J11.j9 ; port TDCOUT3.FRAME1_P  [project net FRAME1_P]
HA08_N: J11.f11 ; port TDCOUT3.SDO1_N
HA08_P: J11.f10 ; port TDCOUT3.SDO1_P
HA09_N: J11.e10 ; port TDCOUT3.SDO3_N
HA09_P: J11.e9 ; port TDCOUT3.SDO3_P
HA10_N: J11.k14 ; port ADC_OUT1.OUT0_N
HA10_P: J11.k13 ; port ADC_OUT1.OUT0_P
HA11_N: J11.j13 ; port ADC_OUT1.OUT6_N
HA11_P: J11.j12 ; port ADC_OUT1.OUT6_P
HA12_N: J11.f14 ; port ADC_OUT1.OUT5_N
HA12_P: J11.f13 ; port ADC_OUT1.OUT5_P
HA13_N: J11.e13 ; port ADC_OUT1.OUT7_N
HA13_P: J11.e12 ; port ADC_OUT1.OUT7_P
HA14_N: J11.j16 ; port ADC_OUT1.OUT3_N
HA14_P: J11.j15 ; port ADC_OUT1.OUT3_P
HA15_N: J11.f17 ; port ADC_OUT1.OUT1_N
HA15_P: J11.f16 ; port ADC_OUT1.OUT1_P
HA16_N: J11.e16 ; port ADC_OUT1.OUT4_N
HA16_P: J11.e15 ; port ADC_OUT1.OUT4_P
HA17_CC_N: J11.k17 ; port ADC_OUT1.ADCLK_N  [project net ADCLK_N]
HA17_CC_P: J11.k16 ; port ADC_OUT1.ADCLK_P  [project net ADCLK_P]
HA18_N: J11.j19 ; port ADC_OUT1.OUT2_N
HA18_P: J11.j18 ; port ADC_OUT1.OUT2_P
HA19_N: J11.f20  [also labelled TDC_PAR_VADJ3]
HA19_P: J11.f19  [also labelled TDC_INT_VADJ3]
HA20_N: J11.e19 ; port TDC_SSN3_VADJ
HA20_P: J11.e18 TP37.1
HA21_N: J11.k20 ; port ADC_MISO_VADJ  [project net ADC_MISO_VADJ]
HA21_P: J11.k19 TP38.1
HA22_N: J11.j22 ; port ADC_SSN0_VADJ  [project net ADC_SSN0_VADJ]
HA22_P: J11.j21 ; port ADC_SCK_VADJ  [project net ADC_SCK_VADJ]
HA23_N: J11.k23 ; port TDC_DIS1.SIG_N  [project net DISABLE_N]
HA23_P: J11.k22 ; port TDC_DIS1.SIG_P  [project net DISABLE_P]
HB00_CC_N: J11.k26 ; port ADC_OUT0.ADCLK_N  [project net ADCLK_N]
HB00_CC_P: J11.k25 ; port ADC_OUT0.ADCLK_P  [project net ADCLK_P]
HB01_N: J11.j25 ; port ADC_OUT0.OUT7_N
HB01_P: J11.j24 ; port ADC_OUT0.OUT7_P
HB02_N: J11.f23 ; port ADC_OUT0.OUT0_N
HB02_P: J11.f22 ; port ADC_OUT0.OUT0_P
HB03_N: J11.e22 ; port ADC_OUT0.OUT3_N
HB03_P: J11.e21 ; port ADC_OUT0.OUT3_P
HB04_N: J11.f26 ; port ADC_OUT0.OUT6_N
HB04_P: J11.f25 ; port ADC_OUT0.OUT6_P
HB05_N: J11.e25 ; port ADC_OUT0.OUT4_N
HB05_P: J11.e24 ; port ADC_OUT0.OUT4_P
HB06_CC_N: J11.k29 ; port ADC_OUT0.LCLK_N
HB06_CC_P: J11.k28 ; port ADC_OUT0.LCLK_P
HB07_N: J11.j28 ; port ADC_OUT0.OUT5_N
HB07_P: J11.j27 ; port ADC_OUT0.OUT5_P
HB08_N: J11.f29 ; port ADC_OUT0.OUT2_N
HB08_P: J11.f28 ; port ADC_OUT0.OUT2_P
HB09_N: J11.e28 ; port ADC_OUT0.OUT1_N
HB09_P: J11.e27 ; port ADC_OUT0.OUT1_P
HB10_N: J11.k32 ; port TDC_DIS0.SIG_N  [project net DISABLE_N]
HB10_P: J11.k31 ; port TDC_DIS0.SIG_P  [project net DISABLE_P]
HB11_N: J11.j31 TP40.1
HB11_P: J11.j30 TP39.1
HB12_N: J11.f32 ; port TRIG.SIG_N
HB12_P: J11.f31 ; port TRIG.SIG_P
HB13_N: J11.e31 ; port TDCOUT0.SDO0_N
HB13_P: J11.e30 ; port TDCOUT0.SDO0_P
HB14_N: J11.k35 ; port TDCOUT0.FRAME3_N  [project net FRAME3_N]
HB14_P: J11.k34 ; port TDCOUT0.FRAME3_P  [project net FRAME3_P]
HB15_N: J11.j34 ; port TDCOUT0.FRAME1_N  [project net FRAME1_N]
HB15_P: J11.j33 ; port TDCOUT0.FRAME1_P  [project net FRAME1_P]
HB16_N: J11.f35 ; port TDCOUT0.SDO2_N
HB16_P: J11.f34 ; port TDCOUT0.SDO2_P
HB17_CC_N: J11.k38 ; port TDCOUT0.LCLKOUT_N
HB17_CC_P: J11.k37 ; port TDCOUT0.LCLKOUT_P
HB18_N: J11.j37 ; port TDCOUT0.SDO3_N
HB18_P: J11.j36 ; port TDCOUT0.SDO3_P
HB19_N: J11.e34 ; port TDCOUT0.SDO1_N
HB19_P: J11.e33 ; port TDCOUT0.SDO1_P
HB20_N: J11.f38 ; port TDCOUT0.FRAME0_N  [project net FRAME0_N]
HB20_P: J11.f37 ; port TDCOUT0.FRAME0_P  [project net FRAME0_P]
HB21_N: J11.e37 ; port TDCOUT0.FRAME2_N  [project net FRAME2_N]
HB21_P: J11.e36 ; port TDCOUT0.FRAME2_P  [project net FRAME2_P]
LA00_CC_N: J11.g7 ; port TDCOUT2.LCLKOUT_N
LA00_CC_P: J11.g6 ; port TDCOUT2.LCLKOUT_P
LA01_CC_N: J11.d9 ; port TDC_DIS2.SIG_N  [project net DISABLE_N]
LA01_CC_P: J11.d8 ; port TDC_DIS2.SIG_P  [project net DISABLE_P]
LA02_N: J11.h8 ; port TDCOUT2.SDO3_N
LA02_P: J11.h7 ; port TDCOUT2.SDO3_P
LA03_N: J11.g10 ; port TDCOUT2.FRAME3_N  [project net FRAME3_N]
LA03_P: J11.g9 ; port TDCOUT2.FRAME3_P  [project net FRAME3_P]
LA04_N: J11.h11 ; port TDCOUT2.SDO2_N
LA04_P: J11.h10 ; port TDCOUT2.SDO2_P
LA05_N: J11.d12 ; port TDCOUT2.SDO1_N
LA05_P: J11.d11 ; port TDCOUT2.SDO1_P
LA06_N: J11.c11 ; port TDCOUT2.FRAME2_N  [project net FRAME2_N]
LA06_P: J11.c10 ; port TDCOUT2.FRAME2_P  [project net FRAME2_P]
LA07_N: J11.h14 ; port TDCOUT2.SDO0_N
LA07_P: J11.h13 ; port TDCOUT2.SDO0_P
LA08_N: J11.g13 ; port TDCOUT2.FRAME1_N  [project net FRAME1_N]
LA08_P: J11.g12 ; port TDCOUT2.FRAME1_P  [project net FRAME1_P]
LA09_N: J11.d15 ; port TDCOUT2.FRAME0_N  [project net FRAME0_N]
LA09_P: J11.d14 ; port TDCOUT2.FRAME0_P  [project net FRAME0_P]
LA10_N: J11.c15 ; port TDC_DIS3.SIG_N  [project net DISABLE_N]
LA10_P: J11.c14 ; port TDC_DIS3.SIG_P  [project net DISABLE_P]
LA11_N: J11.h17 ; port ADC_SSN1_VADJ  [project net ADC_SSN1_VADJ]
LA11_P: J11.h16  [also labelled TDC_PAR_VADJ2]
LA12_N: J11.g16  [also labelled TDC_INT_VADJ2]
LA12_P: J11.g15 ; port TDC_SSN2_VADJ
LA13_N: J11.d18 ; port TRIG_DIR_VADJ
LA13_P: J11.d17 ; port TDC_MOSI_VADJ
LA14_N: J11.c19 ; port CLK_SSN_VADJ
LA14_P: J11.c18 ; port TRIG_TERM_VADJ
LA15_N: J11.h20 ; port TDC_SCK_VADJ
LA15_P: J11.h19 ; port ADC_RESETn_VADJ
LA16_N: J11.g19 ; port TDC_MISO_VADJ
LA16_P: J11.g18 ; port ADC_MOSI_VADJ  [project net ADC_MOSI_VADJ]
LA17_CC_N: J11.d21 ; port TDCOUT1.LCLKOUT_N
LA17_CC_P: J11.d20 ; port TDCOUT1.LCLKOUT_P
LA18_CC_N: J11.c23 TP36.1
LA18_CC_P: J11.c22 TP35.1
LA19_N: J11.h23 ; port TDCOUT1.FRAME3_N  [project net FRAME3_N]
LA19_P: J11.h22 ; port TDCOUT1.FRAME3_P  [project net FRAME3_P]
LA20_N: J11.g22 ; port TDCOUT1.SDO3_N
LA20_P: J11.g21 ; port TDCOUT1.SDO3_P
LA21_N: J11.h26 ; port TDCOUT1.SDO1_N
LA21_P: J11.h25 ; port TDCOUT1.SDO1_P
LA22_N: J11.g25 ; port TDCOUT1.FRAME2_N  [project net FRAME2_N]
LA22_P: J11.g24 ; port TDCOUT1.FRAME2_P  [project net FRAME2_P]
LA23_N: J11.d24 ; port TDCOUT1.SDO2_N
LA23_P: J11.d23 ; port TDCOUT1.SDO2_P
LA24_N: J11.h29 ; port TDCOUT1.FRAME0_N  [project net FRAME0_N]
LA24_P: J11.h28 ; port TDCOUT1.FRAME0_P  [project net FRAME0_P]
LA25_N: J11.g28 ; port TDCOUT1.SDO0_N
LA25_P: J11.g27 ; port TDCOUT1.SDO0_P
LA26_N: J11.d27 ; port TDCOUT1.FRAME1_N  [project net FRAME1_N]
LA26_P: J11.d26 ; port TDCOUT1.FRAME1_P  [project net FRAME1_P]
LA27_N: J11.c27 ; port SCL_VADJ
LA27_P: J11.c26 ; port SDA_VADJ
LA28_N: J11.h32  [also labelled TDC_INT_VADJ1]
LA28_P: J11.h31  [also labelled TDC_PAR_VADJ1]
LA29_N: J11.g31 ; port PGOOD_VADJ
LA29_P: J11.g30 ; port REF_SEL_VADJ
LA30_N: J11.h35 ; port IDX_SRC_SEL_VADJ
LA30_P: J11.h34 ; port ADC_SYNC_VADJ
LA31_N: J11.g34 ; port TDC_SSN0_VADJ
LA31_P: J11.g33 ; port TDC_SSN1_VADJ
LA32_N: J11.h38 ; port IDX_IN.SIG_N  [project net IDX_N]
LA32_P: J11.h37 ; port IDX_IN.SIG_P  [project net IDX_P]
LA33_N: J11.g37  [also labelled TDC_INT_VADJ0]
LA33_P: J11.g36  [also labelled TDC_PAR_VADJ0]
PG_M2C: J11.f1
REFA_N: R121.1 ; port FMC_REFCLK_N
REFA_P: R120.1 ; port FMC_REFCLK_P
SCL: J11.c30 ; port SCL
SDA: J11.c31 ; port SDA
TDI: J11.d30 J11.d31
VIO_B_M2C: J11.k40
VREF_A_M2C: J11.h1

Not connected (* = marked no-connect by the designer): J11 a2* a3* a6* a7* a10* a11* a14* a15* a18* a19* a22* a23* a26* a27* a30* a31* a34* a35* a38* a39* b4* b5* b8* b9* b12* b13* b16* b17* b20* b21* b24* b25* b28* b29* b32* b33* b36* b37* b40* c2* c3* c6* c7* d1* d4* d5* d29* d33* d34* j39 k1*

### Buses and harness runs
bus TDC_INT_VADJ[3..0] = port TDC_INT_VADJ[3..0]
bus TDC_PAR_VADJ[3..0] = port TDC_PAR_VADJ[3..0]

### Layout directives
differential pair: CLK2_BIDIR_N, CLK2_BIDIR_P, CLK3_BIDIR_N, CLK3_BIDIR_P

### Notes on the sheet
- in AFCK in one of FMC connectors HB lines are routed to HP bank. This means that it is always 1.8V regardless of the VADJ voltage
- DP1_M2C_P
- DP1_M2C_N
- DPO_C2M_P
- DPO_C2M_N
- PG_C2M
- GBTCLK0_M2C_P
- DP2_M2C_P
- DP2_M2C_N
- DPO_M2C_P
- DPO_M2C_N
- GBTCLK0_M2C_N
- DP3_M2C_P
- DP3_M2C_N
- DP4_M2C_P
- DP4_M2C_N
- DP5_M2C_P
- DP5_M2C_N
- DP1_C2M_P
- DP1_C2M_N
- DP2_C2M_P
- DP2_C2M_N
- DP3_C2M_P
- DP3_C2M_N
- (near J11) TDO
- DP4_C2M_P
- DP4_C2M_N
- DP5_C2M_P
- DP5_C2M_N
- RES0
- (near J11) PRSNT_M2C_L
- VIO_B_M2C
- EEPROM
- (near J11) Check the right pin to route CLK signals and reference clock signals...
- Project/Equipment
- Document
- Designer
- Drawn by
- Check.by
- Copyright WUT ISE 2018.
  This documentation describes Open Hardware and is licensed under the CERN OHL v.1.1. You may redistribute and modify this documentation under the terms of the CERN OHL v.1.1. (http://ohwr.org/CERNOHL). This documentation is distributed WITHOUT ANY EXPRESS OR IMPLIED WARRANTY, INCLUDING OF MERCHANTABILITY, SATISFACTORY QUALITY AND FITNESS FOR A PARTICULAR PURPOSE. Please see the CERN OHL v.1.1 for applicable conditions.
- Contact
- File
- Last Mod.
- Print Date
- Sheet
- Size
- A3
- of
- Rev
- (in symbol R0402_0R_JUMPER) 1%
- (in symbol R0603_4K7_1%_0.1W_100PPM) 1%

### Library data of the parts
B3 B4 B7 B8 = PLATED_HOLE3.0_PAD6.0: Single Terminal Socket; Part Description: Plated Through Hole: Hole Dia.=3.0mm Pad Dia.=6.0mm; Mounted: No; Table: Pads; Part Number: PLATED_HOLE3.0_PAD6.0; Component Kind: Standard (No BOM); Component Type: Standard (No BOM); Designator: Single Terminal Socket; Library Reference: Single Terminal Socket; Pin Count: 1; Family: Plated Hole; Socket: No; SMD: No; Status: None; ComponentHeight: 0mm; Author: CERN DEM JLC; CreateDate: 26.05.2008; LatestRevisionDate: 26.05.2008; PackageDescription: Plated Through Hole: Hole Dia.=3.0mm Pad Dia.=6.0mm
J11 = SAMTEC_ASP-134488-01: Connector VITA 57, 400 Male contacts in 10 row abcdefghj; Part Description: 400 contacts (10 rows abcdefghj) Surface Mount Male Connector, VITA 57 (MC-HPC-10); Manufacturer: SAMTEC; Part Number: SAMTEC_ASP-134488-01; Component Kind: Standard; Component Type: Standard; Pin Count: 400; Family: VITA 57; Mounted: Yes; Socket: No; SMD: Yes; Status: None; Manufacturer Part Number: ASP-134488-01; ComponentHeight: 6.1mm; HelpURL: \\cern.ch\dfs\Applications\Altium\Datasheets\SAMTEC_ASP-134488-01.pdf; Author: CERN DEM JLC; CreateDate: 30/04/2009; LatestRevisionDate: 17/08/2009; Table: SAMTEC
R119 = R0603_4K7_1%_0.1W_100PPM: Resistor - 1%; Part Description: General Purpose Thick Film Chip Resistor; Manufacturer: GENERIC; Manufacturer1 Part Number: NRC06F4701TRF; Power: 0.1W; TC: ±100ppm/°C; Table: Resistors SMD; Part Number: R0603_4K7_1%_0.1W_100PPM; Component Kind: Standard; Component Type: Standard; Pin Count: 2; Value: 4k7; Status: Preferred; Tolerance: ±1%; Manufacturer Part Number: R0603_4K7_1%_0.1W_100PPM; Case: 0603; Mounted: Yes; Socket: No; SMD: Yes; Manufacturer1 Example: NIC COMPONENT; Manufacturer1 ComponentHeight: 0.55mm; HelpURL: \\cern.ch\dfs\Applications\Altium\Datasheets\R0603_NIC_NRC.pdf; Author: CERN DEM JLC; CreateDate: 03/12/2007; LatestRevisionDate: 13/03/2008
R120 R121 = R0402_0R_JUMPER: Resistor - 1%; Part Description: 1A (0.05R Max DC Resistance) Zero Ohm Jumper; Manufacturer: GENERIC; Manufacturer1 Part Number: 232270591001L; Table: Resistors SMD; Part Number: R0402_0R_JUMPER; Component Kind: Standard; Component Type: Standard; Pin Count: 2; Value: 0; Status: Not recommended; Manufacturer Part Number: R0402_0R_JUMPER; Case: 0402; Mounted: Yes; Socket: No; SMD: Yes; Manufacturer1 Example: YAGEO PHYCOMP; Manufacturer1 ComponentHeight: 0.4mm; HelpURL: \\cern.ch\dfs\Applications\Altium\Datasheets\R0402_Phycomp_RC0402.pdf; Author: CERN DEM JLC; CreateDate: 3/12/2007; LatestRevisionDate: 17/10/2012
TP35-TP40 = SMD_PAD_1.27X1.27MM: Part Description: 1.27mm x 1.27mm PCB Copper Area (SMD Test Point); Mounted: No; Part Number: SMD_PAD_1.27X1.27MM; Component Kind: Standard (No BOM); Component Type: Standard (No BOM); Pin Count: 1; Family: Test Point; Socket: No; SMD: Yes; Sense: No; Status: None; ComponentHeight: 0mm; HelpURL: Undefined; Author: CERN DEM JLC; CreateDate: 12.01.2008; LatestRevisionDate: 12.01.2008; PackageDescription: 1.27mm x 1.27mm PCB Copper Area (SMD Test Point)